# EAGLE design LDA_Board (EAGLE 7.6.0)
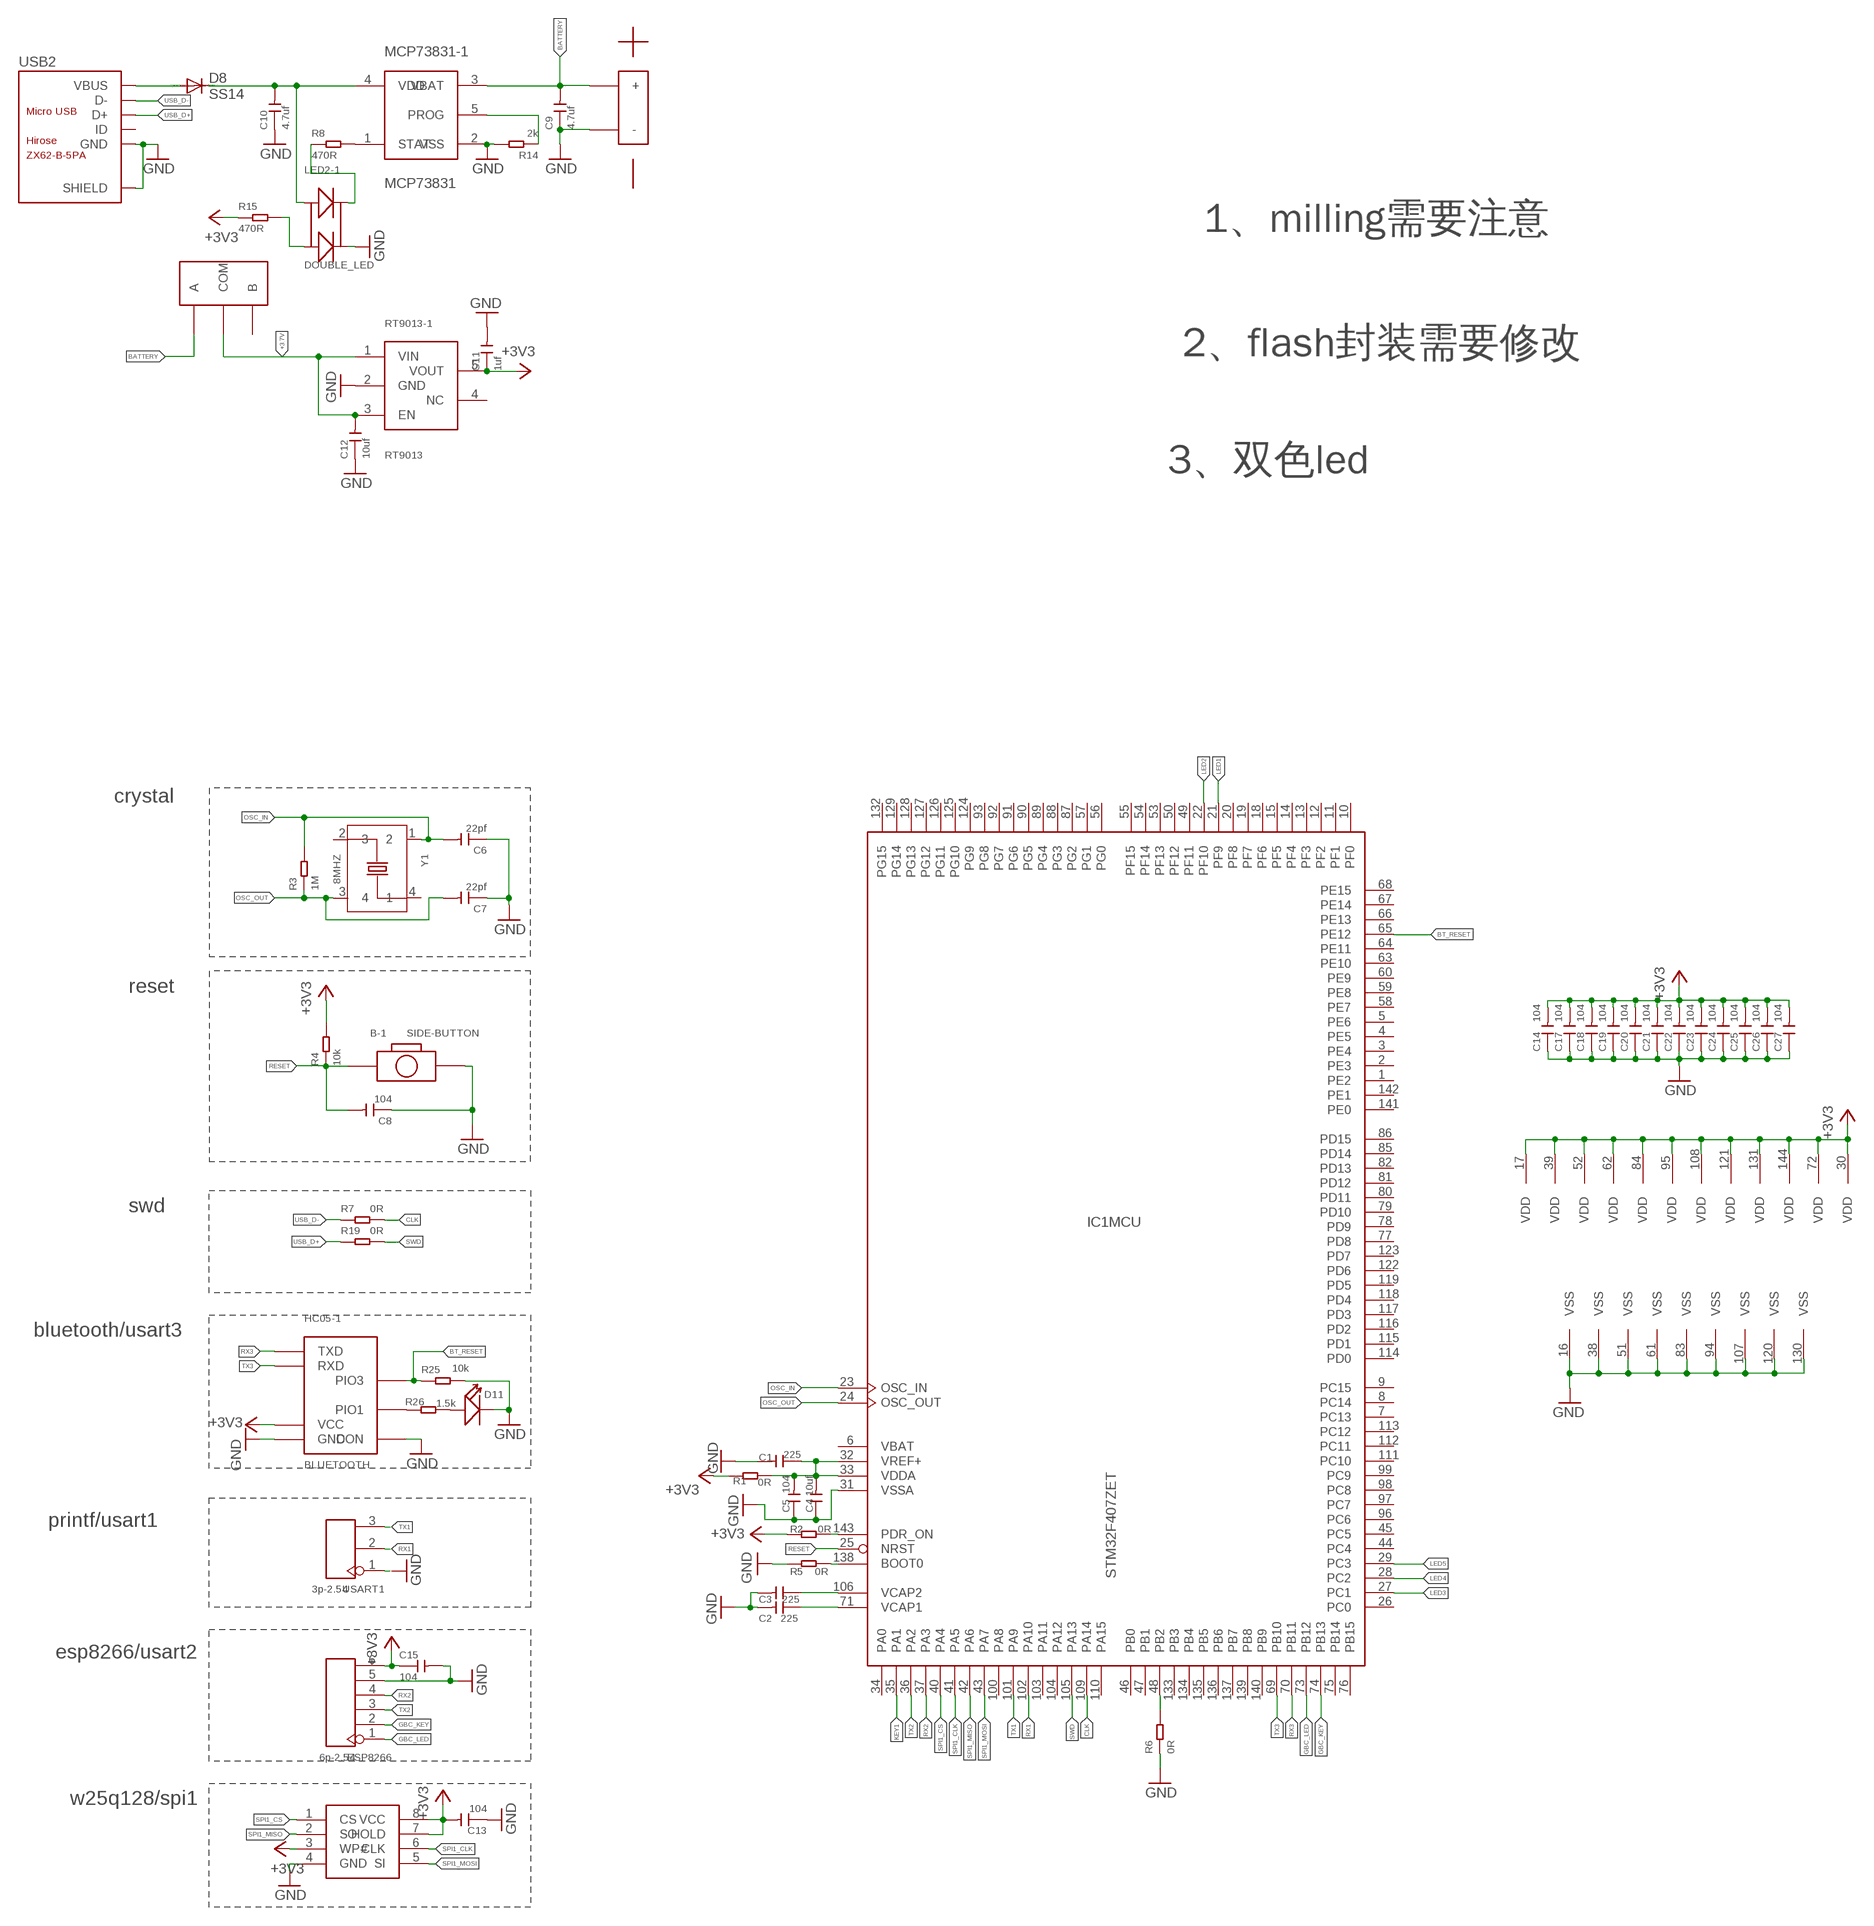
[diagram p0: schematic, sheet 1, part 1 of 2]
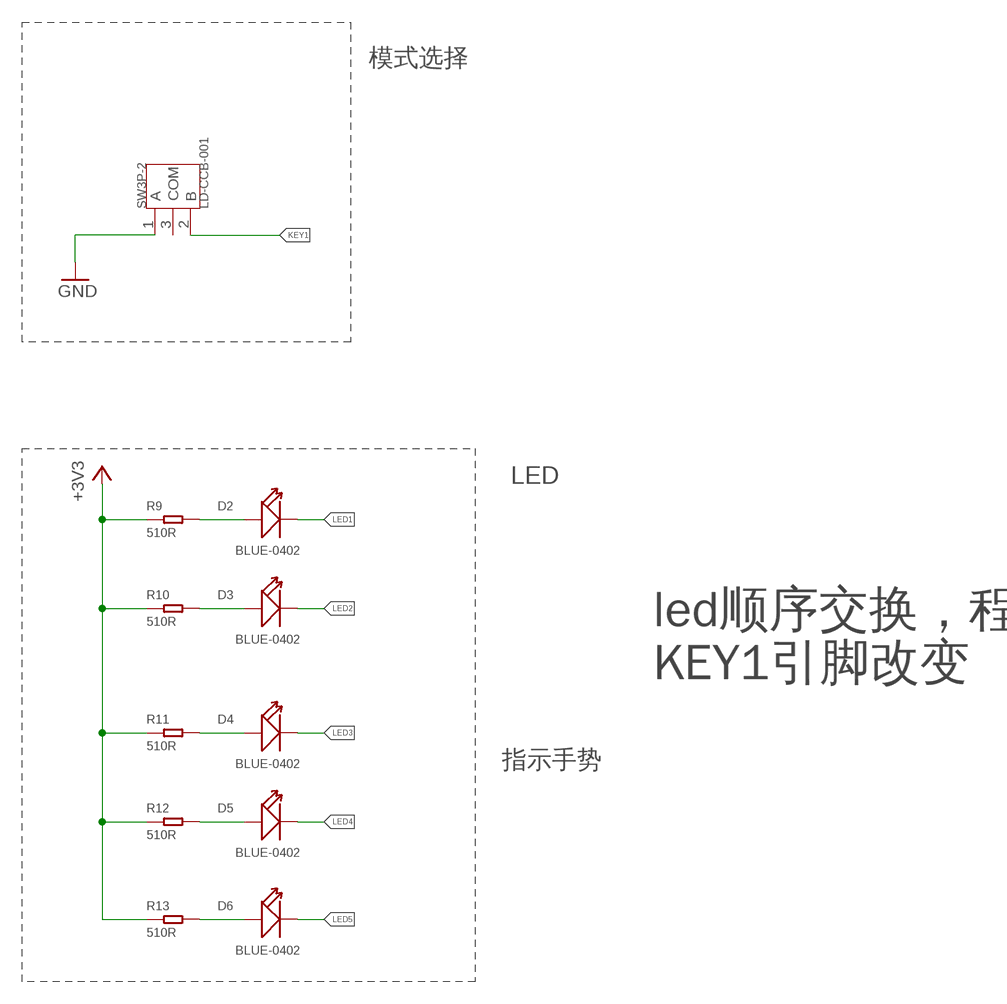
[diagram p1: schematic, sheet 1, part 2 of 2]

## Parts
B-1  SIDE-BUTTON  [SIDE-BUTTON]
BATTERY-1  BATTERY  [BATTERY]
C1  225  CAP-(0402)  [C0402]
C2  225  CAP-(0402)  [C0402]
C3  225  CAP-(0402)  [C0402]
C4  10uf  CAP-(0402)  [C0402]
C5  104  CAP-(0402)  [C0402]
C6  22pf  CAP-(0402)  [C0402]
C7  22pf  CAP-(0402)  [C0402]
C8  104  CAP-(0402)  [C0402]
C9  4.7uf  CAP-(0402)  [C0402]
C10  4.7uf  CAP-(0402)  [C0402]
C11  1uf  CAP-(0402)  [C0402]
C12  10uf  CAP-(0402)  [C0402]
C13  104  CAP-(0402)  [C0402]
C14  104  CAP-(0402)  [C0402]
C15  104  CAP-(0402)  [C0402]
C17  104  CAP-(0402)  [C0402]
C18  104  CAP-(0402)  [C0402]
C19  104  CAP-(0402)  [C0402]
C20  104  CAP-(0402)  [C0402]
C21  104  CAP-(0402)  [C0402]
C22  104  CAP-(0402)  [C0402]
C23  104  CAP-(0402)  [C0402]
C24  104  CAP-(0402)  [C0402]
C25  104  CAP-(0402)  [C0402]
C26  104  CAP-(0402)  [C0402]
C27  104  CAP-(0402)  [C0402]
D2  BLUE-0402  LED-(0402)  [LED-0402]
D3  BLUE-0402  LED-(0402)  [LED-0402]
D4  BLUE-0402  LED-(0402)  [LED-0402]
D5  BLUE-0402  LED-(0402)  [LED-0402]
D6  BLUE-0402  LED-(0402)  [LED-0402]
D8  SS14  [SMA]
D11  BLUE-0402  LED-(0402)  [LED-0402]
ESP8266  6p-2.54  DIP-BLACK-FEMALE-HEADER-VERT(6P-2.54)  [H6-2.54]
HC05-1  BLUETOOTH  [BLUETOOTH]
IC1  STM32F407ZET  [LQFP144]
LED2-1  DOUBLE_LED  [LED2-SMD-1010]
MCP73831-1  MCP73831  [SOT23-5]
R1  0R  RES-(0402)  [R0402]
R2  0R  RES-(0402)  [R0402]
R3  1M  RES-(0402)  [R0402]
R4  10k  RES-(0402)  [R0402]
R5  0R  RES-(0402)  [R0402]
R6  0R  RES-(0402)  [R0402]
R7  0R  RES-(0402)  [R0402]
R8  470R  RES-(0402)  [R0402]
R9  510R  RES-(0402)  [R0402]
R10  510R  RES-(0402)  [R0402]
R11  510R  RES-(0402)  [R0402]
R12  510R  RES-(0402)  [R0402]
R13  510R  RES-(0402)  [R0402]
R14  2k  RES-(0402)  [R0402]
R15  470R  RES-(0402)  [R0402]
R19  0R  RES-(0402)  [R0402]
R25  10k  RES-(0402)  [R0402]
R26  1.5k  RES-(0402)  [R0402]
RT9013-1  RT9013  [SOT23-5]
SW3P-2  LD-CCB-001  SWITCH(3P)  [SW3-2.54-9.0X3.5X3.5+2.0MM]
SW-1  SWITCH-3P  [SWITCH-3P]
USART1  3p-2.54  DIP-BLACK-FEMALE-HEADER-VERT(3P-2.54)  [H3-2.54]
USB2  ZX62-B-5PA  MICRO-USB-SMD(ZX62-B-5PA)  [MICRO-USB5+6P-SMD-0.65-AB]
W25Q128  W25Q128  [SOP08]
Y1  8MHZ  SMD-CRYSTAL-27.12MHZ-18PF-30PPM-60R(4P-3.2X2.5MM)  [X4-SMD-3.2X2.5X0.7MM]

## Nets
+3.7V: C12.2 RT9013-1.1(VIN) RT9013-1.3(EN) SW-1.P$2(COM)
+3V3: C11.1 C13.2 C14.2 C15.1 C17.2 C18.2 C19.2 C20.2 C21.2 C22.2 C23.2 C24.2 C25.2 C26.2 C27.2 ESP8266.6 HC05-1.P$12(VCC) IC1.17(PWR:VDD) IC1.30(PWR:VDD) IC1.39(PWR:VDD) IC1.52(PWR:VDD) IC1.62(PWR:VDD) IC1.72(PWR:VDD) IC1.84(PWR:VDD) IC1.95(PWR:VDD) IC1.108(PWR:VDD) IC1.121(PWR:VDD) IC1.131(PWR:VDD) IC1.144(PWR:VDD) R1.1 R2.1 R4.2 R9.1 R10.1 R11.1 R12.1 R13.1 R15.1 RT9013-1.5(VOUT) W25Q128.3(WP#) W25Q128.7(HOLD) W25Q128.8(VCC)
+5V: C10.2 D8.C LED2-1.1 MCP73831-1.4(VDD)
BATTERY: BATTERY-1.P$1(+) C9.2 MCP73831-1.3(VBAT) SW-1.P$3(A)
BT_RESET: HC05-1.P$26(PIO3) IC1.65(MCU:PE12) R25.1
CLK: IC1.109(MCU:PA14) R7.2
GBC_KEY: ESP8266.2 IC1.74(MCU:PB13)
GBC_LED: ESP8266.1 IC1.73(MCU:PB12)
GND: B-1.P$1 BATTERY-1.P$2(-) C1.2 C2.2 C3.2 C4.1 C5.1 C6.1 C7.1 C8.1 C9.1 C10.1 C11.2 C12.1 C13.1 C14.1 C15.2 C17.1 C18.1 C19.1 C20.1 C21.1 C22.1 C23.1 C24.1 C25.1 C26.1 C27.1 D11.- ESP8266.5 HC05-1.P$13(GND) HC05-1.P$22(CON) IC1.16(PWR:VSS) IC1.31(MCU:VSSA) IC1.38(PWR:VSS) IC1.51(PWR:VSS) IC1.61(PWR:VSS) IC1.83(PWR:VSS) IC1.94(PWR:VSS) IC1.107(PWR:VSS) IC1.120(PWR:VSS) IC1.130(PWR:VSS) LED2-1.3 MCP73831-1.2(VSS) R5.1 R6.1 R14.2 R25.2 RT9013-1.2(GND) SW3P-2.1(A) USART1.1 USB2.5(GND) USB2.P1(SHIELD) USB2.P2(SHIELD) USB2.P3(SHIELD) USB2.P4(SHIELD) USB2.P5(SHIELD) USB2.P6(SHIELD) W25Q128.4(GND)
KEY1: IC1.35(MCU:PA1) SW3P-2.2(B)
LED1: D2.- IC1.21(MCU:PF9)
LED2: D3.- IC1.22(MCU:PF10)
LED3: D4.- IC1.27(MCU:PC1)
LED4: D5.- IC1.28(MCU:PC2)
LED5: D6.- IC1.29(MCU:PC3)
N$1: IC1.138(MCU:BOOT0) R5.2
N$2: C2.1 IC1.71(MCU:VCAP1)
N$3: C3.1 IC1.106(MCU:VCAP2)
N$4: IC1.48(MCU:PB2) R6.2
N$5: C1.1 C4.2 C5.2 IC1.32(MCU:VREF+) IC1.33(MCU:VDDA) R1.2
N$6: MCP73831-1.1(STAT) R8.2
N$7: IC1.143(MCU:PDR_ON) R2.2
N$8: D2.+ R9.2
N$9: D3.+ R10.2
N$11: MCP73831-1.5(PROG) R14.1
N$13: D4.+ R11.2
N$14: D5.+ R12.2
N$15: D6.+ R13.2
N$16: LED2-1.4 R8.1
N$17: LED2-1.2 R15.2
N$19: HC05-1.P$24(PIO1) R26.1
N$20: D11.+ R26.2
OSC_IN: C6.2 IC1.23(MCU:OSC_IN) R3.2 Y1.1
OSC_OUT: C7.2 IC1.24(MCU:OSC_OUT) R3.1 Y1.3
RESET: B-1.P$2 C8.2 IC1.25(MCU:NRST) R4.1
RX1: IC1.102(MCU:PA10) USART1.2
RX2: ESP8266.4 IC1.37(MCU:PA3)
RX3: HC05-1.P$1(TXD) IC1.70(MCU:PB11)
SPI1_CLK: IC1.41(MCU:PA5) W25Q128.6(CLK)
SPI1_CS: IC1.40(MCU:PA4) W25Q128.1(CS)
SPI1_MISO: IC1.42(MCU:PA6) W25Q128.2(SO)
SPI1_MOSI: IC1.43(MCU:PA7) W25Q128.5(SI)
SWD: IC1.105(MCU:PA13) R19.2
TX1: IC1.101(MCU:PA9) USART1.3
TX2: ESP8266.3 IC1.36(MCU:PA2)
TX3: HC05-1.P$2(RXD) IC1.69(MCU:PB10)
USB_D+: R19.1 USB2.3(D+)
USB_D-: R7.1 USB2.2(D-)
VBUS: D8.A USB2.1(VBUS)
Unconnected: IC1.1(MCU:PE2) IC1.2(MCU:PE3) IC1.3(MCU:PE4) IC1.4(MCU:PE5) IC1.5(MCU:PE6) IC1.7(MCU:PC13) IC1.8(MCU:PC14) IC1.9(MCU:PC15) IC1.10(MCU:PF0) IC1.11(MCU:PF1) IC1.12(MCU:PF2) IC1.13(MCU:PF3) IC1.14(MCU:PF4) IC1.15(MCU:PF5) IC1.18(MCU:PF6) IC1.19(MCU:PF7) IC1.20(MCU:PF8) IC1.26(MCU:PC0) IC1.34(MCU:PA0) IC1.44(MCU:PC4) IC1.45(MCU:PC5) IC1.46(MCU:PB0) IC1.47(MCU:PB1) IC1.49(MCU:PF11) IC1.50(MCU:PF12) IC1.53(MCU:PF13) IC1.54(MCU:PF14) IC1.55(MCU:PF15) IC1.56(MCU:PG0) IC1.57(MCU:PG1) IC1.58(MCU:PE7) IC1.59(MCU:PE8) IC1.60(MCU:PE9) IC1.63(MCU:PE10) IC1.64(MCU:PE11) IC1.66(MCU:PE13) IC1.67(MCU:PE14) IC1.68(MCU:PE15) IC1.75(MCU:PB14) IC1.76(MCU:PB15) IC1.77(MCU:PD8) IC1.78(MCU:PD9) IC1.79(MCU:PD10) IC1.80(MCU:PD11) IC1.81(MCU:PD12) IC1.82(MCU:PD13) IC1.85(MCU:PD14) IC1.86(MCU:PD15) IC1.87(MCU:PG2) IC1.88(MCU:PG3) IC1.89(MCU:PG4) IC1.90(MCU:PG5) IC1.91(MCU:PG6) IC1.92(MCU:PG7) IC1.93(MCU:PG8) IC1.96(MCU:PC6) IC1.97(MCU:PC7) IC1.98(MCU:PC8) IC1.99(MCU:PC9) IC1.100(MCU:PA8) IC1.103(MCU:PA11) IC1.104(MCU:PA12) IC1.110(MCU:PA15) IC1.111(MCU:PC10) IC1.112(MCU:PC11) IC1.113(MCU:PC12) IC1.114(MCU:PD0) IC1.115(MCU:PD1) IC1.116(MCU:PD2) IC1.117(MCU:PD3) IC1.118(MCU:PD4) IC1.119(MCU:PD5) IC1.122(MCU:PD6) IC1.123(MCU:PD7) IC1.124(MCU:PG9) IC1.125(MCU:PG10) IC1.126(MCU:PG11) IC1.127(MCU:PG12) IC1.128(MCU:PG13) IC1.129(MCU:PG14) IC1.132(MCU:PG15) IC1.133(MCU:PB3) IC1.134(MCU:PB4) IC1.135(MCU:PB5) IC1.136(MCU:PB6) IC1.137(MCU:PB7) IC1.139(MCU:PB8) IC1.140(MCU:PB9) IC1.141(MCU:PE0) IC1.142(MCU:PE1) RT9013-1.4(NC) SW3P-2.3(COM) SW-1.P$1(B) USB2.4(ID) Y1.2 Y1.4

## Notes on the sheet
- 1、milling需要注意
- 2、flash封装需要修改
- 3、双色led
- crystal
- 模式选择
- reset
- LED
- swd
- led顺序交换，程序注意
  KEY1引脚改变
- bluetooth/usart3
- 指示手势
- printf/usart1
- esp8266/usart2
- w25q128/spi1

## Power pins joined to a net without a drawn wire
VBAT: IC1.6(MCU:VBAT)

## Library data of the parts
B-1 = 1-LDA_Board:SIDE-BUTTON
BATTERY-1 = 1-LDA_Board:BATTERY
C1-C15 C17-C27 = 1-LDA_Board:CAP-(0402): 302010041; MPN: GRM1555C1H150JA01D; VALUE: 15pf
D2-D6 D11 = 1-LDA_Board:LED-(0402): 304090075; MPN: BL-HB337A-AV-TRB
D8 = 1-LDA_Board:SS14
ESP8266 = Seeed-OPL-Connector:DIP-BLACK-FEMALE-HEADER-VERT(6P-2.54): 320030060; MPN: F185-1106A1BSYC1
HC05-1 = 1-LDA_Board:BLUETOOTH
IC1 = 1-LDA_Board:STM32F407Z*T: ARM 32-bit Cortex™-M3 CPU 168 MHz maximum frequency 512 to 1024 Kbytes of Flash memory 192 kbytes of SRAM 114 GPIOs 1.8 to 3.6 V application supply
LED2-1 = 1-LDA_Board:DOUBLE_LED
MCP73831-1 = 1-LDA_Board:MCP73831
R1 R2 R5-R7 R19 = 1-LDA_Board:RES-(0402): 301010000; MPN: RC0402JR-070RL
R3 R4 R8-R15 R25 R26 = 1-LDA_Board:RES-(0402): 301010000; MPN: RC0402JR-070RL; VALUE: 0R
RT9013-1 = 1-LDA_Board:RT9013
SW3P-2 = 1-LDA_Board:SWITCH(3P): 311030006; MPN: LD-CCB-001
SW-1 = 1-LDA_Board:SWITCH-3P
USART1 = Seeed-OPL-Connector:DIP-BLACK-FEMALE-HEADER-VERT(3P-2.54): 320030024; MPN: F185-1103A0BSYA1
USB2 = 1-LDA_Board:MICRO-USB-SMD(ZX62-B-5PA): 320010005; MPN: ZX62-B-5PA
W25Q128 = 1-LDA_Board:W25Q128
Y1 = 1-LDA_Board:SMD-CRYSTAL-27.12MHZ-18PF-30PPM-60R(4P-3.2X2.5MM): 306010027; MPN: 7M-27.120MAAJ-T; VALUE: 27.12MHZ

## Board
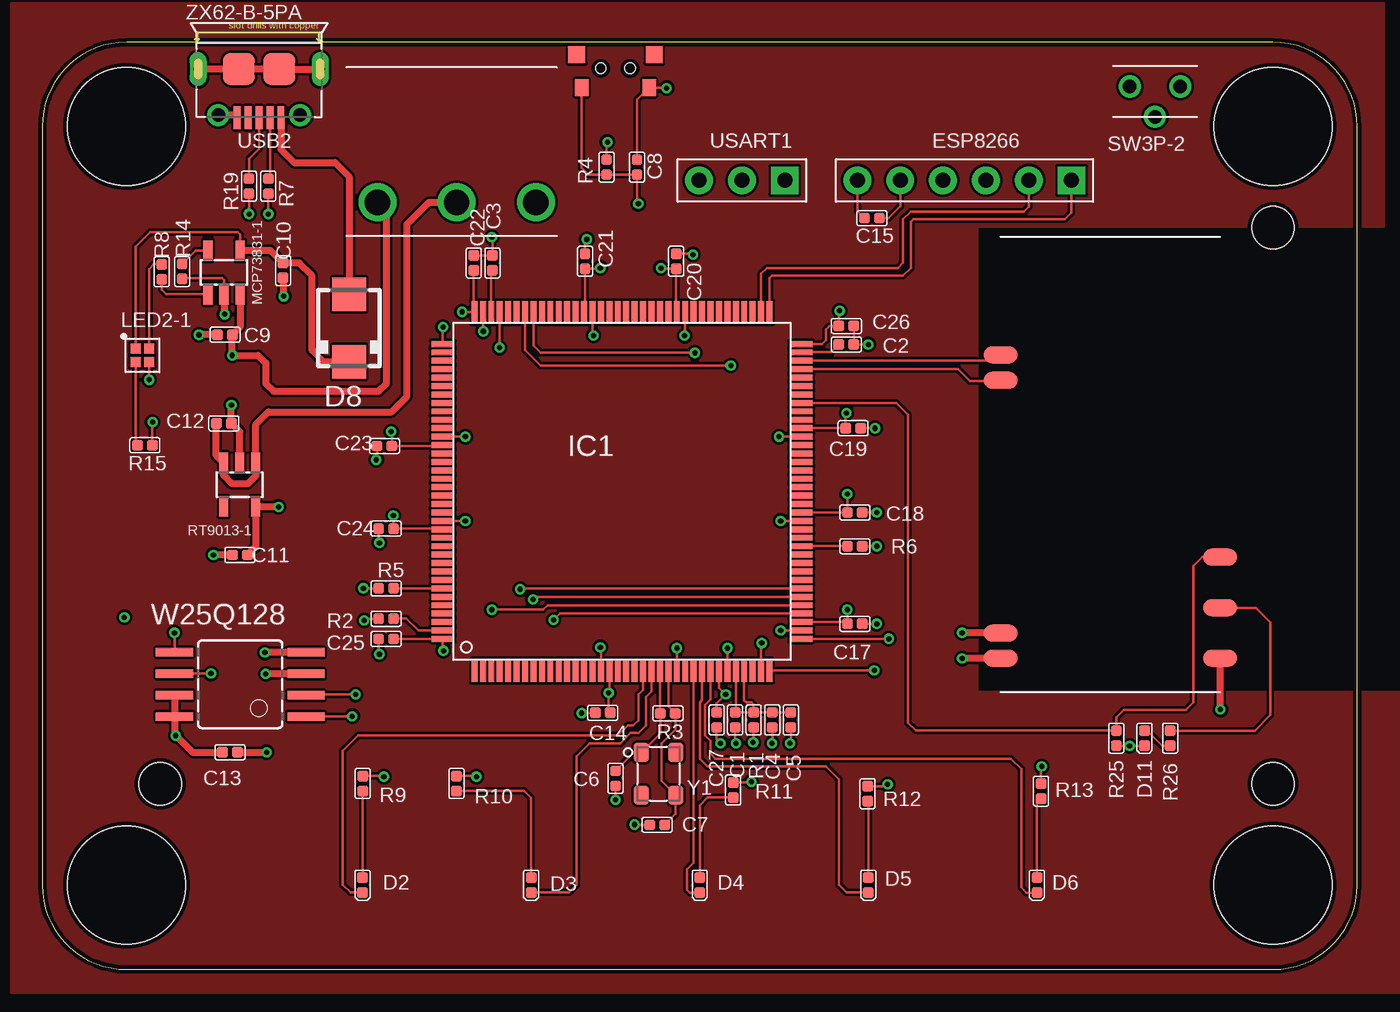
[diagram p2: board, top side]
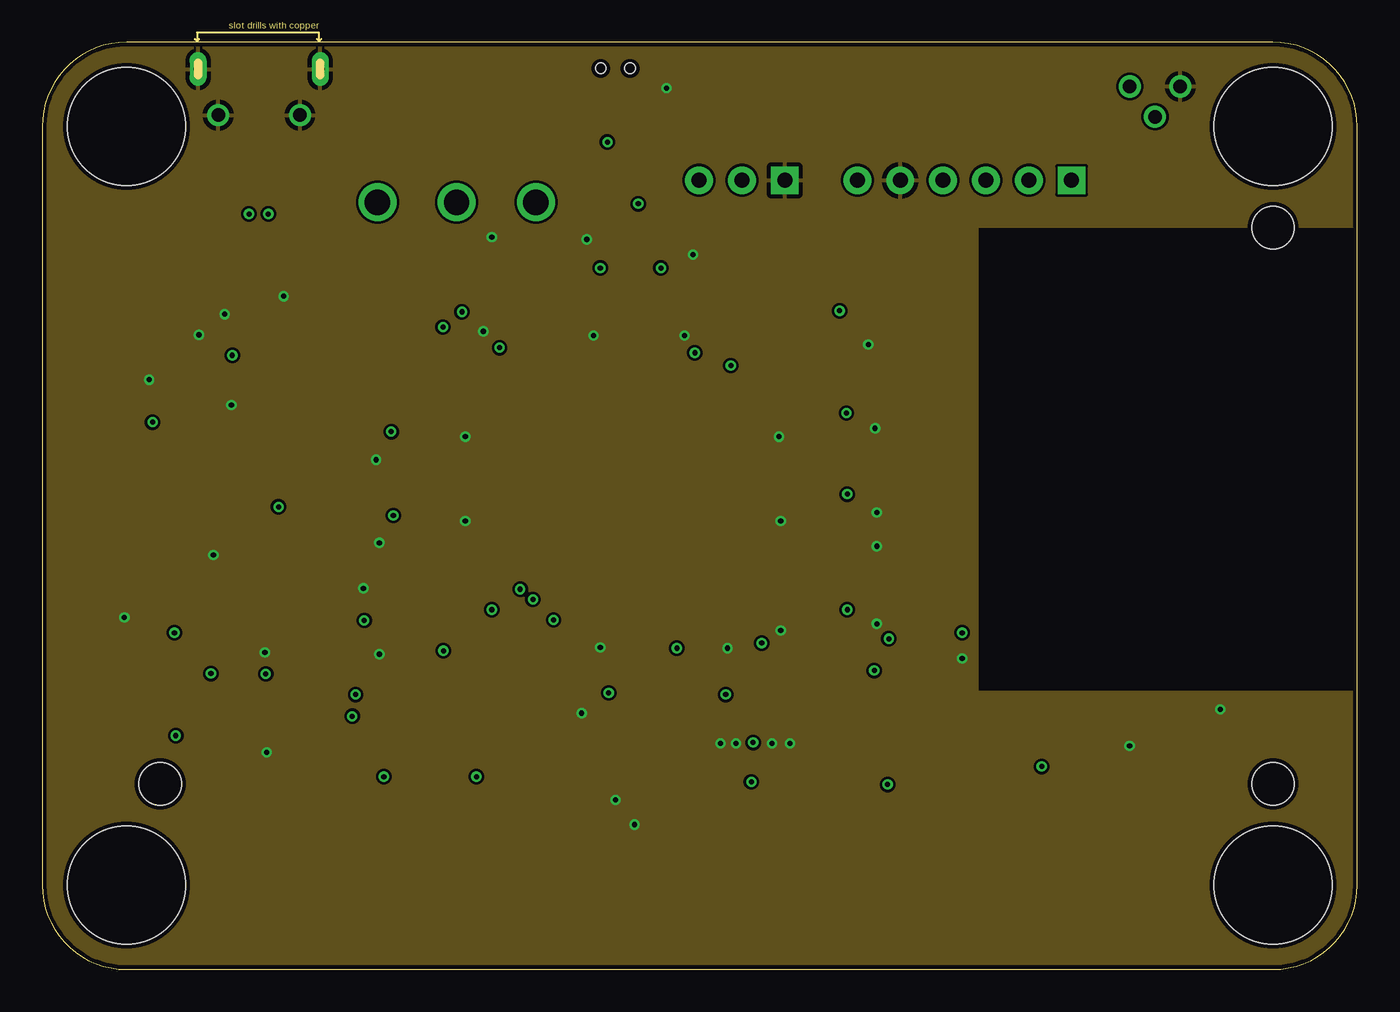
[diagram p3: board, inner layer GND]
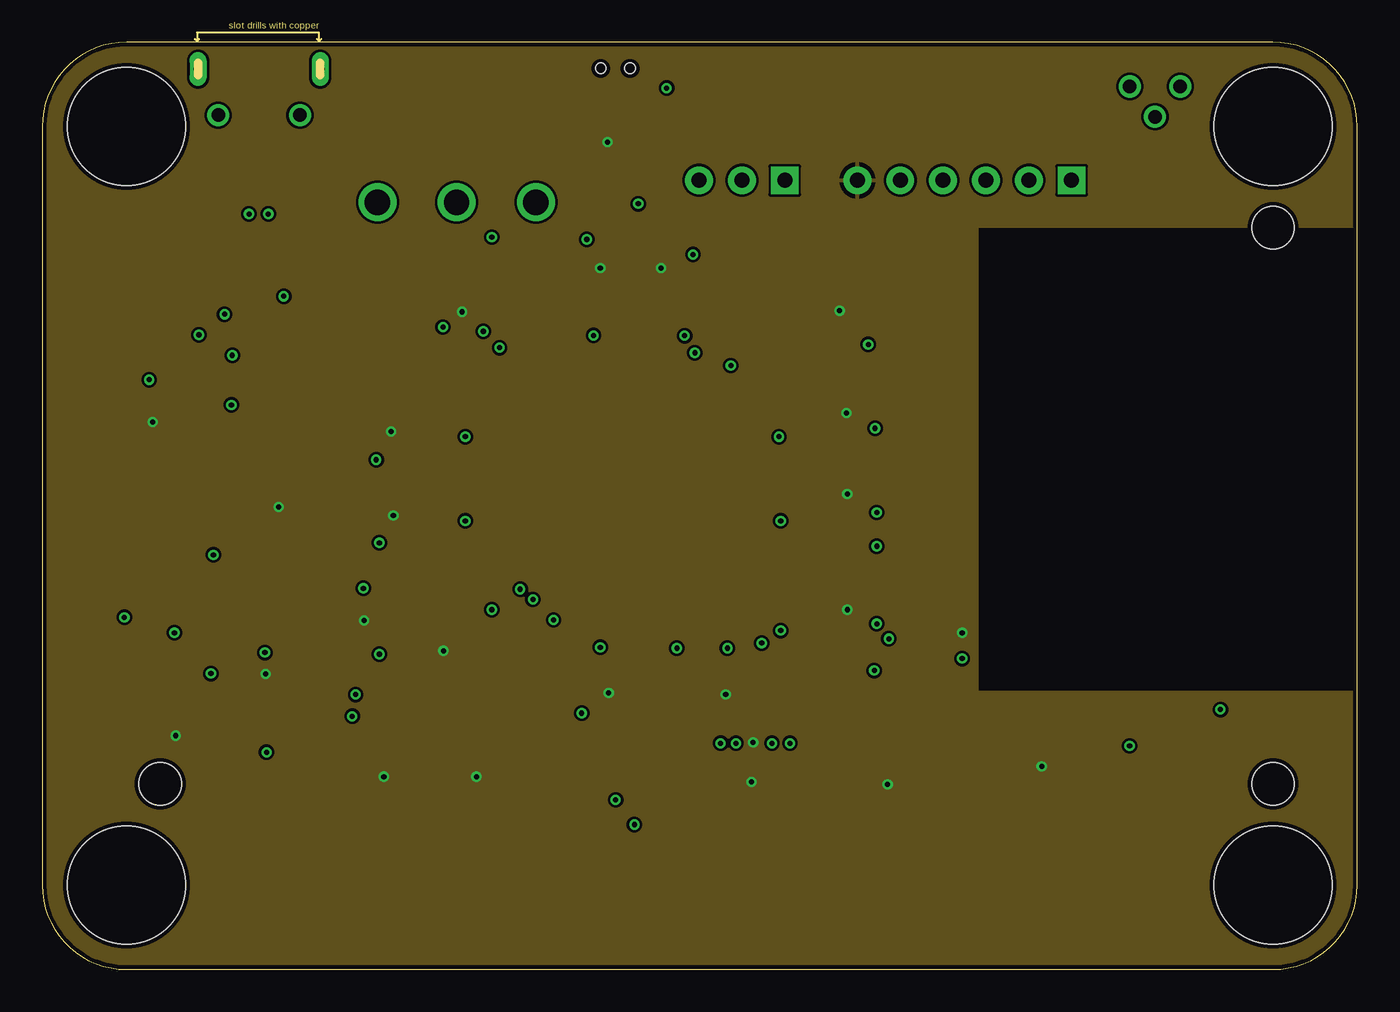
[diagram p4: board, inner layer VCC]
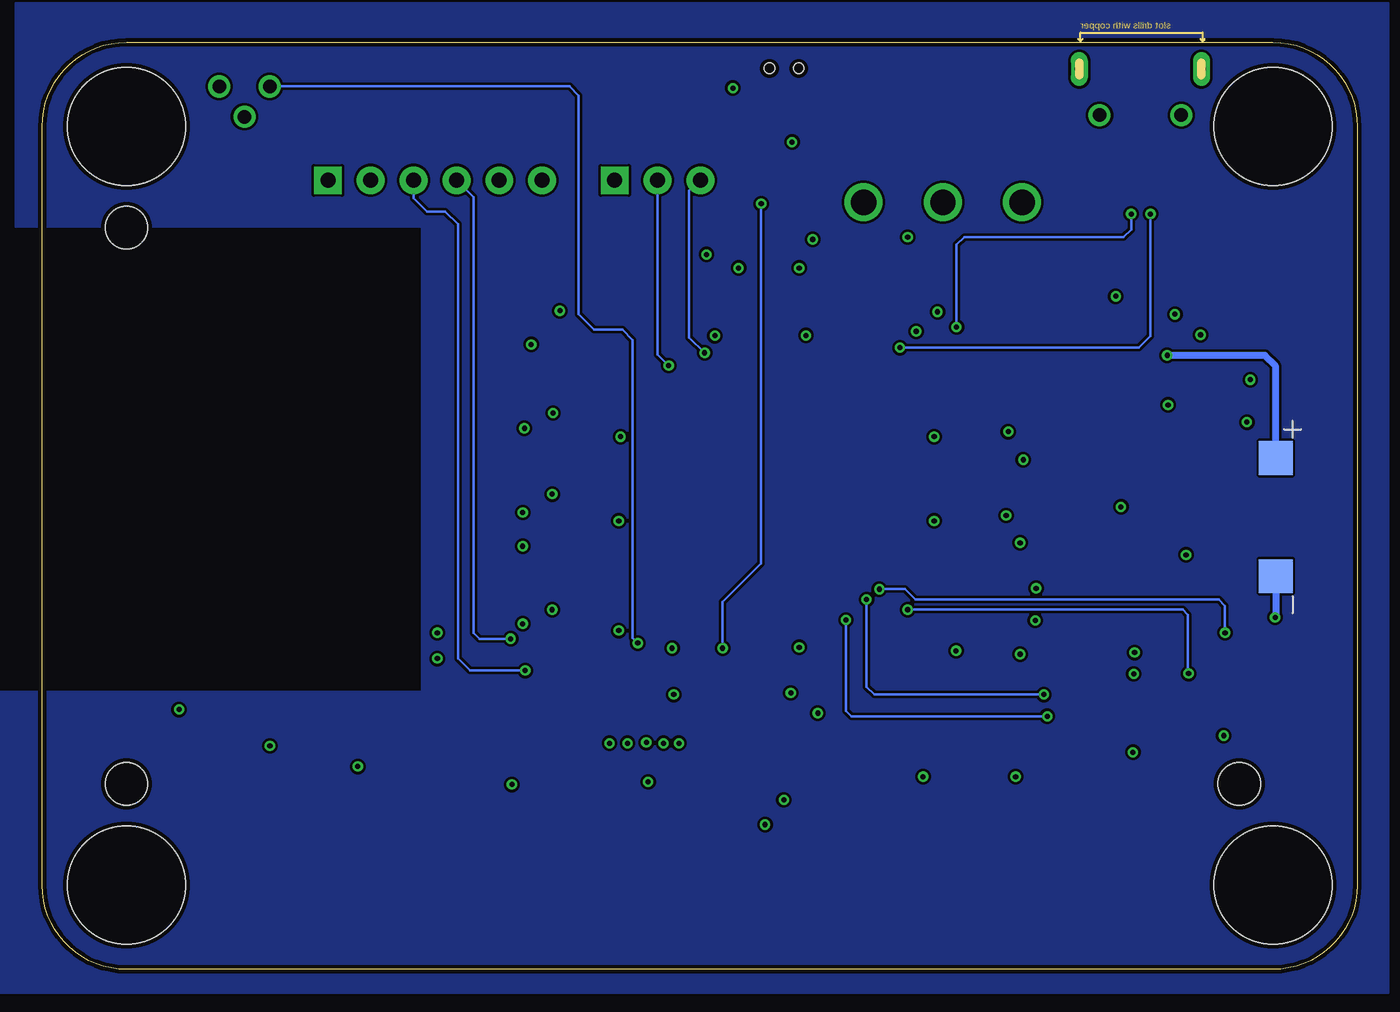
[diagram p5: board, bottom side, seen from below]

Size 78 x 55 mm. Coordinates in mm from the lower left corner, seen from the top.
Outline: 0,50 0,5 arc90 5,0 73,0 arc90 78,5 78,50 arc90 73,55 5,55 arc90 0,50
Copper layers (1*2+3*16): Top 0.035mm / dielectric 1.5mm / GND 0.035mm / dielectric 0.15mm / VCC 0.035mm / dielectric 0.2mm / Bottom 0.035mm
Design rules "default *": minimum track width 6mil, minimum drill 12mil, track to track 6mil, track to pad 6mil, pad to pad 6mil, via to via 6mil, smd to smd 6mil, copper to edge 10mil, drill to drill 8mil, minimum pad ring 10mil, minimum via ring 6mil, stop-mask expansion 4mil, vias tented up to drill 12mil, thermal gap 10mil
Holes 7 mm at 5,5 5,50 73,5 73,50
Holes 2.5 mm at 73,11 73,44 7,11

### Footprints (pad centres in the part's own frame; a part is rotated, then mirrored left to right if it is on the bottom)
SIDE-BUTTON = smd 0.8 x 1: P$1 -2,1.15; P$2 2,1.15 | smd 1 x 1: P$3 2.3,-0.8; P$4 -2.3,-0.8 | hole 0.6: 0.87,0; -0.87,0
BATTERY = smd 2 x 2: P$1 1,-1; P$2 8,-1
C0402 = smd 0.635 x 0.635: 1 0,0.445; 2 0,-0.445
LED-0402 = smd 0.635 x 0.635: + -0.445,0; - 0.445,0
SMA = smd 2 x 2: A 2,0; C -2,0
H6-2.54 = drill 0.889 pad 1.651 square: 1 0,6.35 | drill 0.889 pad 1.651: 2 0,3.81; 3 0,1.27; 4 0,-1.27; 5 0,-3.81; 6 0,-6.35
BLUETOOTH = smd 2 x 1: P$1 0,0; P$2 0,-1.5; P$12 0,-16.5; P$13 0,-18; P$22 13,-18; P$24 13,-15; P$26 13,-12
LQFP144 = smd 0.35 x 1.35: 1 -8.75,-10.625; 2 -8.25,-10.625; 3 -7.75,-10.625; 4 -7.25,-10.625; 5 -6.75,-10.625; 6 -6.25,-10.625; 7 -5.75,-10.625; 8 -5.25,-10.625; 9 -4.75,-10.625; 10 -4.25,-10.625; 11 -3.75,-10.625; 12 -3.25,-10.625; 13 -2.75,-10.62; 14 -2.25,-10.625; 15 -1.75,-10.625; 16 -1.25,-10.625; 17 -0.75,-10.625; 18 -0.25,-10.625; 19 0.25,-10.625; 20 0.75,-10.625; 21 1.25,-10.625; 22 1.75,-10.625; 23 2.25,-10.625; 24 2.75,-10.62; 25 3.25,-10.625; 26 3.75,-10.625; 27 4.25,-10.625; 28 4.75,-10.625; 29 5.25,-10.625; 30 5.75,-10.625; 31 6.25,-10.625; 32 6.75,-10.625; 33 7.25,-10.625; 34 7.75,-10.625; 35 8.25,-10.625; 36 8.75,-10.625; 73 8.75,10.625; 74 8.25,10.625; 75 7.75,10.625; 76 7.25,10.625; 77 6.75,10.625; 78 6.25,10.625; 79 5.75,10.625; 80 5.25,10.625; 81 4.75,10.625; 82 4.25,10.625; 83 3.75,10.625; 84 3.25,10.625; 85 2.75,10.625; 86 2.25,10.625; 87 1.75,10.625; 88 1.25,10.625; 89 0.75,10.625; 90 0.25,10.625; 91 -0.25,10.625; 92 -0.75,10.625; 93 -1.25,10.625; 94 -1.75,10.625; 95 -2.25,10.625; 96 -2.75,10.625; 97 -3.25,10.625; 98 -3.75,10.625; 99 -4.25,10.625; 100 -4.75,10.625; 101 -5.25,10.625; 102 -5.75,10.625; 103 -6.25,10.625; 104 -6.75,10.625; 105 -7.25,10.625; 106 -7.75,10.625; 107 -8.25,10.625; 108 -8.75,10.625 | smd 1.35 x 0.35: 37 10.625,-8.75; 38 10.625,-8.25; 39 10.625,-7.75; 40 10.625,-7.25; 41 10.625,-6.75; 42 10.625,-6.25; 43 10.625,-5.75; 44 10.625,-5.25; 45 10.625,-4.75; 46 10.625,-4.25; 47 10.625,-3.75; 48 10.625,-3.25; 49 10.625,-2.75; 50 10.625,-2.25; 51 10.625,-1.75; 52 10.625,-1.25; 53 10.625,-0.75; 54 10.625,-0.25; 55 10.625,0.25; 56 10.625,0.75; 57 10.625,1.25; 58 10.625,1.75; 59 10.625,2.25; 60 10.625,2.75; 61 10.625,3.25; 62 10.625,3.75; 63 10.625,4.25; 64 10.625,4.75; 65 10.625,5.25; 66 10.625,5.75; 67 10.625,6.25; 68 10.625,6.75; 69 10.625,7.25; 70 10.625,7.75; 71 10.625,8.25; 72 10.625,8.75; 109 -10.625,8.75; 110 -10.625,8.25; 111 -10.625,7.75; 112 -10.625,7.25; 113 -10.625,6.75; 114 -10.625,6.25; 115 -10.625,5.75; 116 -10.625,5.25; 117 -10.625,4.75; 118 -10.625,4.25; 119 -10.625,3.75; 120 -10.625,3.25; 121 -10.625,2.75; 122 -10.625,2.25; 123 -10.625,1.75; 124 -10.625,1.25; 125 -10.625,0.75; 126 -10.625,0.25; 127 -10.625,-0.25; 128 -10.625,-0.75; 129 -10.625,-1.25; 130 -10.625,-1.75; 131 -10.625,-2.25; 132 -10.625,-2.75; 133 -10.625,-3.25; 134 -10.625,-3.75; 135 -10.625,-4.25; 136 -10.625,-4.75; 137 -10.625,-5.25; 138 -10.625,-5.75; 139 -10.625,-6.25; 140 -10.625,-6.75; 141 -10.625,-7.25; 142 -10.625,-7.75; 143 -10.625,-8.25; 144 -10.625,-8.75
LED2-SMD-1010 = smd 0.6 x 0.6: 1 -0.4,-0.4; 2 0.4,-0.4; 3 0.4,0.4; 4 -0.4,0.4
SOT23-5 = smd 0.55 x 1.2: 1 -0.95,-1.3; 2 0,-1.3; 3 0.95,-1.3; 4 0.95,1.3; 5 -0.95,1.3
R0402 = smd 0.635 x 0.635: 1 0,0.445; 2 0,-0.445
SW3-2.54-9.0X3.5X3.5+2.0MM = drill 0.8 pad 1.3: 1 -1.5,-1.8; 2 1.5,-1.8 | drill 0.8: 3 0,0
SWITCH-3P = drill 1.5: P$1 -4.7,0; P$2 0,0; P$3 4.7,0
H3-2.54 = drill 0.889 pad 1.651 square: 1 0,2.54 | drill 0.889 pad 1.651: 2 0,0; 3 0,-2.54
MICRO-USB5+6P-SMD-0.65-AB = smd 0.4 x 1.35: 1 -1.3,2.875; 2 -0.65,2.875; 3 0,2.875; 4 0.65,2.875; 5 1.3,2.875 | smd 1.9 x 1.9: P1 -1.2,0; P2 1.2,0 | drill 0.508 pad 1.016 long: P3 -3.625,0; P4 3.625,0 | drill 0.8: P5 -2.425,2.73; P6 2.425,2.73
SOP08 = smd 0.5 x 2.2: 1 -1.905,-3.9; 2 -0.645,-3.9; 3 0.625,-3.9; 4 1.895,-3.9; 5 1.905,3.9; 6 0.635,3.9; 7 -0.635,3.9; 8 -1.905,3.9
X4-SMD-3.2X2.5X0.7MM = smd 1.143 x 0.889: 1 -1.27,-1.016; 2 1.27,-1.016; 3 1.27,1.016; 4 -1.27,1.016

### Placement (x,y rotation side)
B-1  34,53.45 180 top
BATTERY-1  3.84,31.33 270 bottom
C1  41.1,14.8 0 top
C2  47.7,37.07 90 top
C3  26.7,41.9 180 top
C4  43.3,14.8 180 top
C5  44.4,14.8 180 top
C6  34,11.33 180 top
C7  36.47,8.58 90 top
C8  35.28,47.59 0 top
C9  10.85,37.65 90 top
C10  14.28,41.46 180 top
C11  11.73,24.58 270 top
C12  10.78,32.39 270 top
C13  11.14,12.88 270 top
C14  33.24,15.22 90 top
C15  49.21,44.56 90 top
C17  48.2,20.5 270 top
C18  48.2,27.1 270 top
C19  48.1,32.1 270 top
C20  37.6,42 0 top
C21  32.2,42 0 top
C22  25.6,41.9 0 top
C23  20.3,31.05 90 top
C24  20.4,26.15 90 top
C25  20.4,19.6 90 top
C26  47.7,38.17 270 top
C27  40,14.8 180 top
D2  19,5 270 top
D3  29,5 270 top
D4  39,5 270 top
D5  49,5 270 top
D6  59,5 270 top
D8  18.2,38.04 90 top
D11  65.38,13.72 270 top
ESP8266  54.7,46.8 270 top
HC05-1  56.86,36.45 0 top
IC1  34.39,28.35 0 top
LED2-1  5.94,36.42 270 top
MCP73831-1  10.79,41.34 0 top
R1  42.2,14.8 180 top
R2  20.4,20.8 90 top
R3  37.11,15.19 270 top
R4  33.47,47.59 180 top
R5  20.4,22.6 90 top
R6  48.2,25.1 270 top
R7  13.41,46.46 0 top
R8  7.09,41.38 0 top
R9  19.01,11.03 0 top
R10  24.57,11.03 0 top
R11  40.98,10.64 0 top
R12  48.95,10.42 0 top
R13  59.24,10.57 0 top
R14  8.31,41.4 0 top
R15  6.1,31.09 270 top
R19  12.26,46.46 0 top
R25  63.7,13.72 0 top
R26  66.9,13.72 0 top
RT9013-1  11.71,28.75 180 top
SW3P-2  66,50.57 180 top
SW-1  24.58,45.5 180 top
USART1  41.5,46.8 270 top
USB2  12.87,53.4 180 top
W25Q128  11.75,16.91 90 top
Y1  36.55,11.6 270 top

### Tracks (layer width: path | path; a pad name or v marks a point on that pad's centre or on a via)
+3.7V
  Top 0.406: SW-1.P$2 22.95,45.5 21.64,44.2 21.64,33.98 20.73,33.07 13.41,33.07 12.66,32.32 RT9013-1.1 12.66,29.28 12.19,28.8 11.28,28.8 10.76,29.32 RT9013-1.3 10.33,30.48 C12.2
+3V3  (via drill 0.3)
  Top 0.152: 33.7,17.66 IC1.17 33.64,16.44 v33.6,16.4 33.6,15.3 C14.2 | 40.14,15.38 C27.2 40,15.77 v40.54,16.31 40.14,16.71 IC1.30 | C17.2 47.65,20.6 | 47.65,20.6 IC1.39 | IC1.52 C18.2 v47.75,28.19 | IC1.62 C19.2 47.66,32.96 v47.7,33 | C26.2 | IC1.84 37.6,39.02 C20.2 36.74,41.56 v36.7,41.6 | IC1.95 32.2,39.04 C21.2 33.06,41.56 v33.1,41.6 | IC1.121 23.71,31.05 C23.2 20.74,31.86 v20.7,31.9 | IC1.131 23.72,26.15 C24.2 20.84,26.91 v20.83,26.92 | C25.2 IC1.144 23.76,18.94 v23.8,18.9 | 47.65,20.6 47.75,20.7 v47.75,21.34 | C26.2 47.25,39.02 v47.3,39.07 | C22.2 25.6,39.02 IC1.108 24.92,38.98 v24.9,39 | R2.1 19.2,20.8 v19.1,20.7 | R1.1 42.2,13.5 v42.16,13.46 | IC1.72 46.25,37.1 46.48,37.34 46.48,37.95 46.7,38.17 C26.2 | R4.2 33.47,49.01 v33.53,49.07 | R9.1 20.23,11.47 v20.27,11.43 | R10.1 25.71,11.47 v25.76,11.43 | R11.1 42.02,11.08 v42.06,11.12 | R12.1 50.03,10.86 v50.14,10.97 | R13.1 59.24,12 v59.28,12.04 | ESP8266.6 48.35,44.97 C15.1 | R15.1 6.54,32.45 v6.55,32.46
  Top 0.406: v14.02,27.43 14,27.45 RT9013-1.5 12.66,25.07 C11.1 | HC05-1.P$12 54.57,19.95 v54.56,19.96 | W25Q128.3 v13.27,17.54 v13.26,17.53 | W25Q128.7 W25Q128.8 7.85,13.95 v7.92,13.87 8.91,12.88 C13.2
  pour VCC: -1.52,58.22 78.94,58.22 78.94,44.04 55.47,44.04 55.47,16.46 78.79,16.46 78.79,-0.76 -1.52,-0.76
+5V
  Top 0.152: LED2-1.1 5.54,42.88 6.4,43.74 11.58,43.74 11.73,43.59 MCP73831-1.4
  Top 0.406: D8.C 16.69,36.04 16,36.73 16,41.15 15.25,41.9 C10.2 13.54,42.64 MCP73831-1.4
BATTERY  (via drill 0.3)
  Top 0.406: MCP73831-1.3 11.74,38.09 C9.2 11.28,37.63 v11.28,36.42 12.8,36.42 13.26,35.97 13.26,34.75 13.72,34.29 19.96,34.29 20.42,34.75 20.42,44.96 SW-1.P$3
  Bottom 0.406: BATTERY-1.P$1 4.84,35.78 5.49,36.42 v11.28,36.42
BT_RESET
  Top 0.152: HC05-1.P$26 68.8,24.45 68.28,23.93 68.28,15.85 67.82,15.39 64.16,15.39 63.7,14.94 R25.1 63.69,14.17 51.82,14.17 51.36,14.63 51.36,32.92 50.67,33.6 IC1.65
CLK  (via drill 0.3)
  Top 0.152: IC1.109 23.76,38.09 v23.77,38.1 | v13.41,44.81 R7.2
  Bottom 0.152: v23.77,38.1 23.77,42.98 23.32,43.43 13.87,43.43 13.41,43.89 v13.41,44.81
GBC_KEY
  Top 0.152: ESP8266.2 58.51,45.25 58.22,44.96 51.51,44.96 51.05,44.5 51.05,41.91 50.75,41.6 42.98,41.6 42.64,41.27 IC1.74
GBC_LED
  Top 0.152: ESP8266.1 61.05,44.9 60.66,44.5 51.66,44.5 51.51,44.35 51.51,41.6 51.05,41.15 43.28,41.15 43.13,41 43.13,38.99 IC1.73
GND  (via drill 0.3)
  Top 0.152: C17.1 v49.5,20.5 | C18.1 v49.5,27.1 | C19.1 v49.4,32.1 | C26.1 C2.2 v48.99,37.07 | C20.1 38.56,42.44 v38.6,42.4 | C21.1 32.2,43.2 v32.3,43.3 | C22.1 C3.2 26.7,43.4 v26.67,43.43 | C23.1 19.86,30.27 v19.81,30.23 | C24.1 19.96,25.34 v20,25.3 | C25.1 19.96,18.74 v20,18.7 | R5.1 v19.06,22.6 v19.05,22.61 | R6.1 v49.5,25.1 | IC1.16 33.14,19.06 v33.1,19.1 | IC1.38 v43.8,20.1 | IC1.31 v40.64,19.05 | IC1.51 v43.8,26.6 | IC1.61 v43.7,31.6 | IC1.83 38.14,37.63 v38.1,37.59 | IC1.94 32.64,37.66 v32.7,37.6 | IC1.107 26.14,37.87 v26.16,37.85 | IC1.120 v25.1,31.6 | IC1.130 v25.1,26.6 | C14.1 32.02,15.22 v32,15.2 | C6.1 v34,10.06 v34.01,10.06 | C7.1 35.14,8.58 v35.13,8.59 | C4.1 43.3,13.43 v43.28,13.41 | C5.1 44.4,13.46 v44.35,13.41 | C1.2 41.1,13.46 v41.15,13.41 | C27.1 40,13.64 v40.23,13.41 | MCP73831-1.2 10.79,40.88 10.67,41 8.35,41 R14.2 | v37.03,52.27 37.01,52.3 B-1.P$1 35.28,51.58 C8.1 | R25.2 63.72,13.26 v64.49,13.26 64.5,13.27 D11.- | C15.2 50.2,44.56 50.9,45.26 50.9,46.79 ESP8266.5 | LED2-1.3 v6.34,34.98 v6.35,34.98
  Top 0.406: USB2.5 11.42,50.67 USB2.P6 | C9.1 v9.3,37.65 v9.3,37.64 | MCP73831-1.2 10.79,38.89 v10.82,38.86 | C10.1 14.28,39.97 v14.33,39.93 | RT9013-1.2 11.71,31.89 C12.1 v11.22,33.47 v11.23,33.48 | C11.2 v10.17,24.58 v10.16,24.59 | HC05-1.P$13 54.57,18.45 v54.56,18.44 | W25Q128.4 v13.22,18.8 v13.21,18.8 | C13.1 v13.31,12.88 | HC05-1.P$22 69.86,15.44 v69.88,15.42 | USB2.P4 USB2.P2 USB2.P1 USB2.P3
  Bottom 0.406: BATTERY-1.P$2 4.84,20.92 v4.88,20.88
  pour GND: -2.74,60.05 79.25,60.05 79.25,44.04 55.47,44.04 55.47,16.46 79.4,16.46 79.4,-1.83 -2.74,-1.83
KEY1  (via drill 0.3)
  Top 0.152: v42.67,19.36 42.64,19.32 IC1.35
  Bottom 0.152: v42.67,19.36 42.98,19.66 42.98,37.34 43.59,37.95 45.26,37.95 46.18,38.86 46.18,51.82 46.73,52.37 SW3P-2.2
LED1
  Top 0.152: IC1.21 35.64,16.59 35.36,16.31 35.36,14.78 35.05,14.48 34.75,14.48 34.14,13.87 18.75,13.87 17.83,12.95 17.83,5.03 18.29,4.57 18.98,4.57 D2.-
LED2
  Top 0.152: IC1.22 36.14,16.48 35.81,16.15 35.81,14.48 35.36,14.02 34.9,14.02 34.29,13.41 32.46,13.41 31.7,12.65 31.7,5.03 31.24,4.57 29.02,4.57 D3.-
LED3
  Top 0.152: IC1.27 38.64,6.33 38.25,5.94 38.25,4.72 38.43,4.55 38.99,4.55 D4.-
LED4
  Top 0.152: IC1.28 39.14,15.97 39.01,15.85 39.01,12.5 39.47,12.04 46.48,12.04 47.24,11.28 47.24,5.03 47.7,4.57 48.98,4.57 D5.-
LED5
  Top 0.152: IC1.29 39.64,16.02 39.32,15.7 39.32,13.87 39.62,13.56 39.62,12.8 39.93,12.5 57.45,12.5 58.06,11.89 58.06,4.88 58.39,4.56 D6.-
N$1
  Top 0.152: IC1.138 R5.2
N$2
  Top 0.152: IC1.71 46.79,36.6 C2.1
N$3
  Top 0.152: IC1.106 26.64,41.39 C3.1
N$4
  Top 0.152: IC1.48 R6.2
N$5
  Top 0.152: IC1.32 41.14,15.28 C1.1 R1.2 | R1.2 C4.2 C5.2 | IC1.33 41.64,15.97 41.76,15.85 42.06,15.85 42.2,15.71 R1.2
N$6
  Top 0.152: MCP73831-1.1 7.36,40.04 7.09,40.31 R8.2
N$7
  Top 0.152: IC1.143 22.32,20.1 21.59,20.83 20.87,20.83 R2.2
N$8
  Top 0.152: D2.+ 19.01,5.46 R9.2
N$9
  Top 0.152: D3.+ 29,10.17 28.58,10.59 R10.2
N$10
  pour Top: -1.83,57.3 79.55,57.3 79.55,44.04 55.47,44.04 55.47,16.46 80.62,16.46 80.62,-1.37 -1.83,-1.37
N$11
  Top 0.152: MCP73831-1.5 9.11,42.64 R14.1
N$12
  pour Bottom: -1.83,57.3 79.55,57.3 79.55,44.04 55.47,44.04 55.47,16.46 80.62,16.46 80.62,-1.37 -1.83,-1.37
N$13
  Top 0.152: D4.+ 39,9.74 39.47,10.21 40.97,10.21 R11.2
N$14
  Top 0.152: D5.+ 49,9.93 R12.2
N$15
  Top 0.152: D6.+ 59,9.89 R13.2
N$16
  Top 0.152: R8.1 6.62,41.83 6.34,41.55 LED2-1.4
N$17
  Top 0.152: LED2-1.2 5.54,31.2 R15.2
N$19
  Top 0.152: HC05-1.P$24 71.97,21.45 72.85,20.57 72.85,15.09 71.92,14.16 R26.1
N$20
  Top 0.152: R26.2 66.43,13.27 65.55,14.16 D11.+
OSC_IN
  Top 0.152: IC1.23 36.64,15.22 R3.2 36.67,14.01 Y1.1 35.1,12.87 C6.2
OSC_OUT
  Top 0.152: IC1.24 37.14,15.61 R3.1 37.56,14.24 36.73,13.41 36.73,11.17 Y1.3 37.56,9.23 C7.2
RESET  (via drill 0.3)
  Top 0.152: IC1.25 v37.64,19.05 | v35.36,45.41 35.28,45.49 C8.2 R4.1 32.41,47.14 32,47.55 B-1.P$2
  Bottom 0.152: v37.64,19.05 37.64,21.79 35.36,24.08 v35.36,45.41
RX1  (via drill 0.3)
  Top 0.152: IC1.102 28.64,36.74 29.57,35.81 v40.84,35.81
  Bottom 0.152: v40.84,35.81 41.5,36.47 USART1.2
RX2  (via drill 0.3)
  Top 0.152: IC1.37 v50.21,19.6 v50.22,19.61
  Bottom 0.152: v50.22,19.61 52.07,19.61 52.43,19.96 52.43,45.8 ESP8266.4
RX3
  Top 0.152: IC1.70 56.51,36.1 HC05-1.P$1
SPI1_CLK  (via drill 0.3)
  Top 0.152: IC1.41 29.98,21.6 29.72,21.34 v26.67,21.34 | v10.01,17.55 W25Q128.6
  Bottom 0.152: v26.67,21.34 10.36,21.34 10.06,21.03 10.06,17.6 v10.01,17.55
SPI1_CS  (via drill 0.3)
  Top 0.152: IC1.40 30.7,21.1 v30.33,20.73 | v18.39,15.01 W25Q128.1
  Bottom 0.152: v30.33,20.73 30.33,15.34 30,15.01 v18.39,15.01
SPI1_MISO  (via drill 0.3)
  Top 0.152: IC1.42 29.27,22.1 v29.11,21.95 | v18.59,16.31 15.69,16.31 W25Q128.2
  Bottom 0.152: v29.11,21.95 29.11,16.76 28.65,16.31 v18.59,16.31
SPI1_MOSI  (via drill 0.3)
  Top 0.152: IC1.43 28.39,22.6 v28.35,22.55 | v7.85,19.96 W25Q128.5
  Bottom 0.152: v28.35,22.55 26.82,22.55 26.21,21.95 8.23,21.95 7.85,21.57 v7.85,19.96
SWD  (via drill 0.3)
  Top 0.152: IC1.105 27.14,36.89 v27.13,36.88 | v12.27,44.81 v12.26,44.81 R19.2
  Bottom 0.152: v27.13,36.88 12.95,36.88 12.27,37.57 v12.27,44.81
TX1  (via drill 0.3)
  Top 0.152: IC1.101 29.14,37 29.57,36.58 v38.71,36.58
  Bottom 0.152: v38.71,36.58 39.62,37.49 39.62,46.18 39,46.8 USART1.3
TX2  (via drill 0.3)
  Top 0.152: IC1.36 v49.35,17.73
  Bottom 0.152: v49.35,17.73 52.63,17.73 53.34,18.44 53.34,44.2 54.1,44.96 55.17,44.96 55.97,45.76 ESP8266.3
TX3
  Top 0.152: IC1.69 54.31,35.6 55.02,34.9 56.8,34.9 HC05-1.P$2
USB_D+
  Top 0.152: R19.1 12.26,48.08 12.87,48.68 USB2.3
USB_D-
  Top 0.152: USB2.2 13.52,47.01 R7.1
VBUS
  Top 0.406: USB2.1 14.17,48.62 14.94,47.85 17.37,47.85 18.2,47.02 D8.A

### Text on the board
tStop: Econ-Tech
Document: 蓝牙 | 电源拨码 / 开关 | 侧边 / 复位键 | 电源状态 / 指示灯 | 拓展串口、wifi | usb充电口 | 5个手势显示灯 | 训练和工作按键 / 训练和工作指示灯